# Altium schematic sheet TK100_Arkitektur.SchDoc
size A4
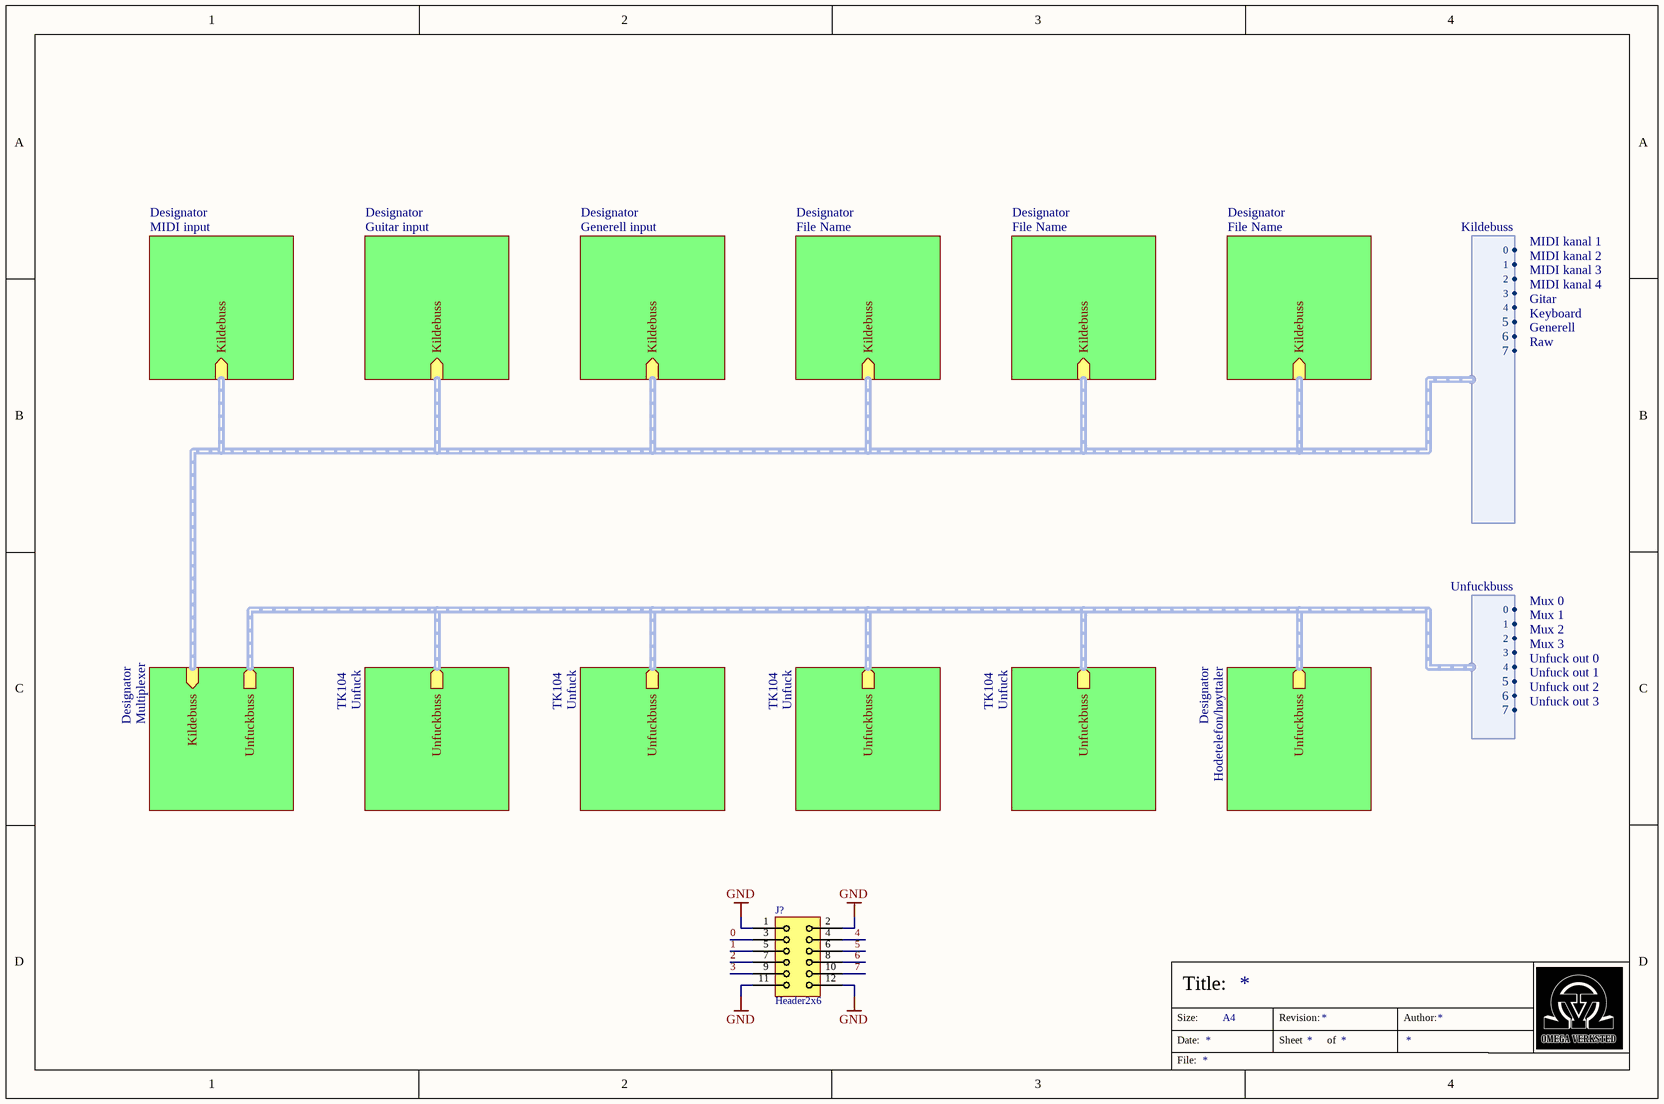
[diagram p0: TK100_Arkitektur.SchDoc]

## Parts
J?  Header2x6  [HDRV12W64P254_2X6]

## Sub-sheets
Designator = Hodetelefon/høyttaler: Unfuckbuss (out, harness Unfuckbuss)
Designator = Multiplexer: Kildebuss (in, harness Kildebuss), Unfuckbuss (out, harness Unfuckbuss)
Designator = MIDI input: Kildebuss (in, harness Kildebuss)
Designator = Guitar input: Kildebuss (in, harness Kildebuss)
Designator = Generell input: Kildebuss (in, harness Kildebuss)
Designator = File Name: Kildebuss (in, harness Kildebuss)
Designator = File Name: Kildebuss (in, harness Kildebuss)
Designator = File Name: Kildebuss (in, harness Kildebuss)
TK104 = Unfuck: Unfuckbuss (out, harness Unfuckbuss)
TK104 = Unfuck: Unfuckbuss (out, harness Unfuckbuss)
TK104 = Unfuck: Unfuckbuss (out, harness Unfuckbuss)
TK104 = Unfuck: Unfuckbuss (out, harness Unfuckbuss)

## Harnesses
Kildebuss: 0, 1, 2, 3, 4, 5, 6, 7
Unfuckbuss: 0, 1, 2, 3, 4, 5, 6, 7

## Nets
GND: J?.1 J?.2 J?.11 J?.12
0: J?.3
1: J?.5
2: J?.7
3: J?.9
4: J?.4
5: J?.6
6: J?.8
7: J?.10

## Buses and harness runs
harness sheet Designator/Unfuckbuss = sheet TK104/Unfuckbuss

## Notes on the sheet
- MIDI kanal 1
- MIDI kanal 2
- MIDI kanal 3
- MIDI kanal 4
- Gitar
- Keyboard
- Generell
- Raw
- Mux 0
- Mux 1
- Mux 2
- Mux 3
- Unfuck out 0
- Unfuck out 1
- Unfuck out 2
- Unfuck out 3
- Size:
- Date:
- Title:
- A4
- Revision:
- Sheet
- of
- Author:
- File:

## Library data of the parts
J? = 4647: id: 4647; pakke_opprettet_av: 815; beskrivelse: Header; pris: 8; pakketype: TH; pakke_opprettet: 2019-02-15 18:35:04; symbol_opprettet_av: 815; symbol_opprettet: 2014-11-13 11:04:02; navn: Header 2X6; nokkelord: Header